# Altium schematic sheet IO.SchDoc
size A4
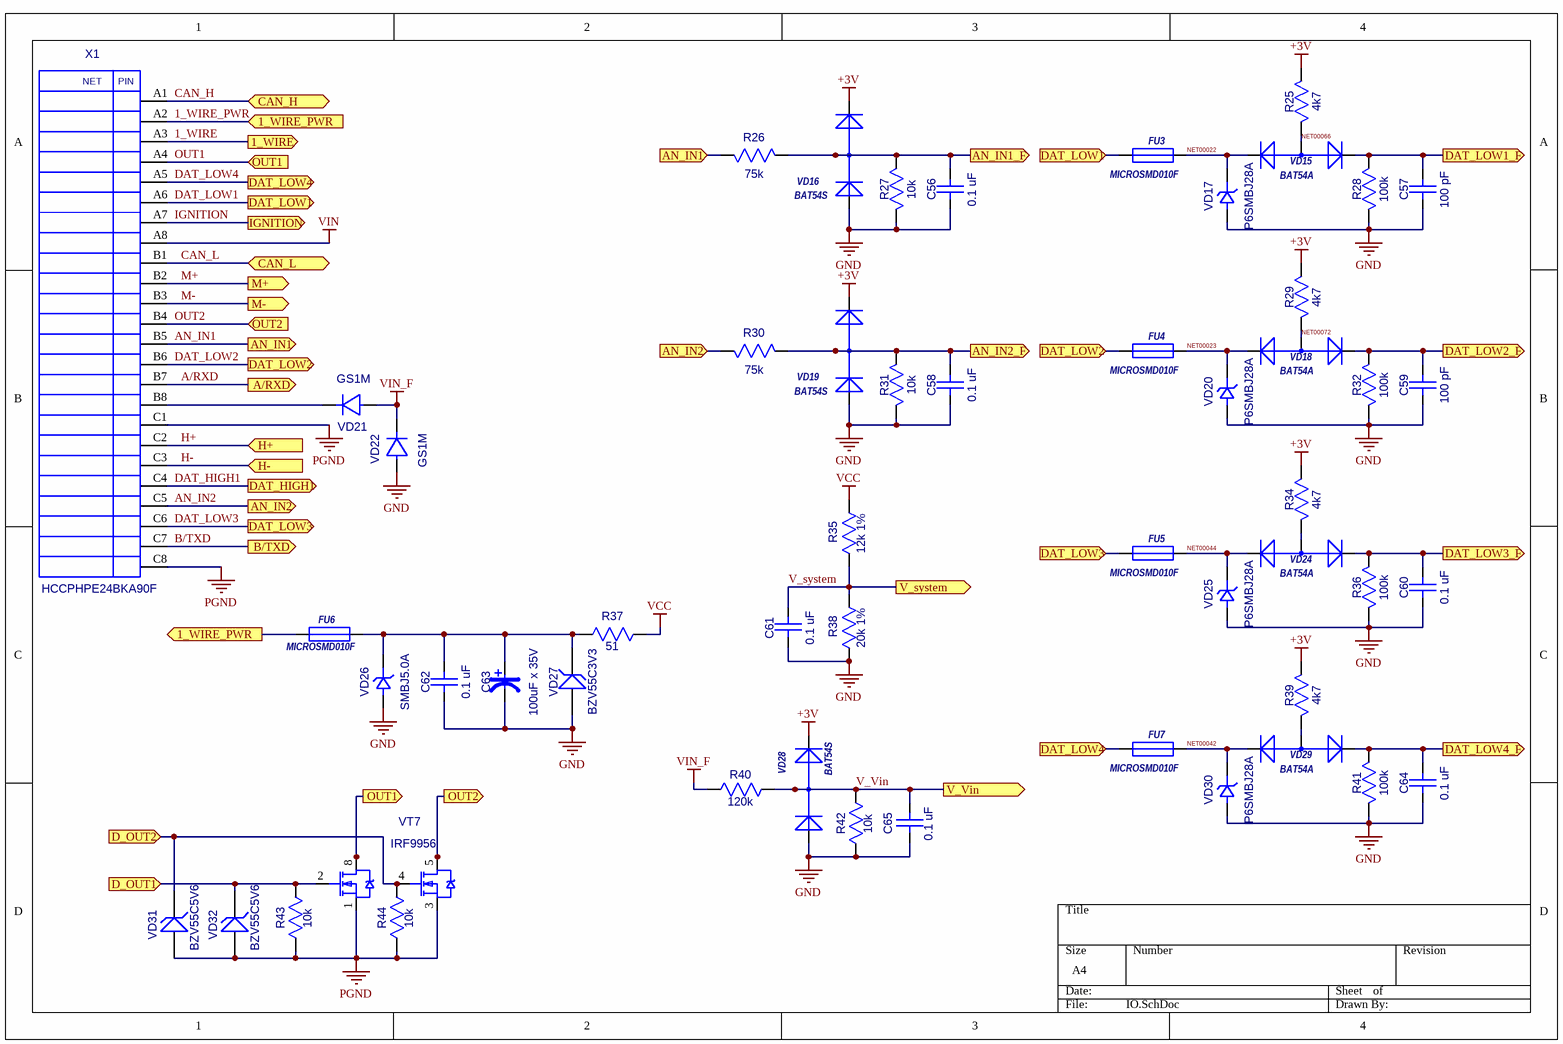
[diagram p0: IO.SchDoc]

## Parts
C56  0.1 uF  [CC0603-3M]
C57  100 pF  [CC0603-3M]
C58  0.1 uF  [CC0603-3M]
C59  100 pF  [CC0603-3M]
C60  0.1 uF  [CC0603-3M]
C61  0.1 uF  [CC0603-3M]
C62  0.1 uF  [CC0603-3M]
C63  100uF x 35V  [CC20X2.54]
C64  0.1 uF  [CC0603-3M]
C65  0.1 uF  [CC0603-3M]
FU3  MICROSMD010F  [RC1210]
FU4  MICROSMD010F  [RC1210]
FU5  MICROSMD010F  [RC1210]
FU6  MICROSMD010F  [RC1210]
FU7  MICROSMD010F  [RC1210]
R25  4k7  [RC0603-3M]
R26  75k  [RC0603-3M]
R27  10k  [RC0603-3M]
R28  100k  [RC0603-3M]
R29  4k7  [RC0603-3M]
R30  75k  [RC0603-3M]
R31  10k  [RC0603-3M]
R32  100k  [RC0603-3M]
R34  4k7  [RC0603-3M]
R35  12k 1%  [RC0603-3M]
R36  100k  [RC0603-3M]
R37  51  [RC1206-2M]
R38  20k 1%  [RC0603-3M]
R39  4k7  [RC0603-3M]
R40  120k  [RC0603-3M]
R41  100k  [RC0603-3M]
R42  10k  [RC0603-3M]
R43  10k  [RC0603-3M]
R44  10k  [RC0603-3M]
VD15  BAT54A  [SOT-23(123)]
VD16  BAT54S  [SOT-23(GSD)]
VD17  P6SMBJ28A  [SMB]
VD18  BAT54A  [SOT-23(123)]
VD19  BAT54S  [SOT-23(GSD)]
VD20  P6SMBJ28A  [SMB]
VD21  GS1M  [SMA]
VD22  GS1M  [SMA]
VD24  BAT54A  [SOT-23(123)]
VD25  P6SMBJ28A  [SMB]
VD26  SMBJ5.0A  [SMB]
VD27  BZV55C3V3  [SOD-80]
VD28  BAT54S  [SOT-23(GSD)]
VD29  BAT54A  [SOT-23(123)]
VD30  P6SMBJ28A  [SMB]
VD31  BZV55C5V6  [SOD-80]
VD32  BZV55C5V6  [SOD-80]
VT7  IRF9956  [SO-8]
X1  HCCPHPE24BKA90F  [HCCPHPE24BKA90F_HCCPHPE24BKA90F(Primary)]

## Ports
1_WIRE (out), 1_WIRE_PWR (in), 1_WIRE_PWR (out), A/RXD, AN_IN1 (in), AN_IN1 (out), AN_IN1_F (out), AN_IN2 (in), AN_IN2 (out), AN_IN2_F (out), B/TXD, CAN_H (bidir), CAN_L (bidir), D_OUT1 (in), D_OUT2 (in), DAT_HIGH1 (out), DAT_LOW1 (in), DAT_LOW1 (out), DAT_LOW1_F (out), DAT_LOW2 (in), DAT_LOW2 (out), DAT_LOW2_F (out), DAT_LOW3 (in), DAT_LOW3 (out), DAT_LOW3_F (out), DAT_LOW4 (in), DAT_LOW4 (out), DAT_LOW4_F (out), H+ (in), H- (in), IGNITION (out), M+ (out), M- (out), OUT1 (in), OUT1 (out), OUT2 (in), OUT2 (out), V_system (out), V_Vin (out)

## Nets
+3V: R25.1(A) R29.1(A) R34.1(A) R39.1(A) VD16.2(K) VD19.2(K) VD28.2(K)
GND: C56.1(A) C57.1(A) C58.1(A) C59.1(A) C60.1(A) C61.2(B) C62.1(A) C63.2(minus) C64.1(A) C65.2(B) R27.2(B) R28.2(B) R31.2(B) R32.2(B) R36.2(B) R38.1(A) R41.2(B) R42.2(B) VD16.1(A) VD17.1(A) VD19.1(A) VD20.1(A) VD22.1(A) VD25.1(A) VD26.1(A) VD27.1(A) VD28.1(A) VD30.1(A)
PGND: R43.2(B) R44.2(B) VD31.1(A) VD32.1(A) VT7.1(S) VT7.3(S) X1.C1 X1.C8
VCC: R35.2(B) R37.2(B)
VIN: X1.A8
VIN_F: R40.2(B) VD21.1(A) VD22.2(K)
1_WIRE: X1.A3 ; port 1_WIRE
1_WIRE_PWR: FU6.2 X1.A2 ; port 1_WIRE_PWR
A/RXD: X1.B7 ; port A/RXD
AN_IN1: R26.2(B) X1.B5 ; port AN_IN1
AN_IN1_F: C56.2(B) R26.1(A) R27.1(A) VD16.3(AK) ; port AN_IN1_F
AN_IN2: R30.2(B) X1.C5 ; port AN_IN2
AN_IN2_F: C58.2(B) R30.1(A) R31.1(A) VD19.3(AK) ; port AN_IN2_F
B/TXD: X1.C7 ; port B/TXD
CAN_H: X1.A1 ; port CAN_H
CAN_L: X1.B1 ; port CAN_L
D_OUT1: R43.1(A) VD32.2 VT7.2(G) ; port D_OUT1
D_OUT2: R44.1(A) VD31.2 VT7.4(G) ; port D_OUT2
DAT_HIGH1: X1.C4 ; port DAT_HIGH1
DAT_LOW1: FU3.2 X1.A6 ; port DAT_LOW1
DAT_LOW1_F: C57.2(B) R28.1(A) VD15.2(K) ; port DAT_LOW1_F
DAT_LOW2: FU4.2 X1.B6 ; port DAT_LOW2
DAT_LOW2_F: C59.2(B) R32.1(A) VD18.2(K) ; port DAT_LOW2_F
DAT_LOW3: FU5.2 X1.C6 ; port DAT_LOW3
DAT_LOW3_F: C60.2(B) R36.1(A) VD24.2(K) ; port DAT_LOW3_F
DAT_LOW4: FU7.2 X1.A5 ; port DAT_LOW4
DAT_LOW4_F: C64.2(B) R41.1(A) VD29.2(K) ; port DAT_LOW4_F
H+: X1.C2 ; port H+
H-: X1.C3 ; port H-
IGNITION: X1.A7 ; port IGNITION
M+: X1.B2 ; port M+
M-: X1.B3 ; port M-
NET00022: FU3.1 VD15.1(K) VD17.2(K)
NET00023: FU4.1 VD18.1(K) VD20.2(K)
NET00042: FU7.1 VD29.1(K) VD30.2(K)
NET00044: FU5.1 VD24.1(K) VD25.2(K)
NET00066: R25.2(B) VD15.3(A)
NET00072: R29.2(B) VD18.3(A)
OUT1: VT7.7(D) VT7.8(D) X1.A4 ; port OUT1
OUT2: VT7.5(D) VT7.6(D) X1.B4 ; port OUT2
V_system: C61.1(A) R35.1(A) R38.2(B) ; port V_system
V_Vin: C65.1(A) R40.1(A) R42.1(A) VD28.3(AK) ; port V_Vin
NetC62_2: C62.2(B) C63.1(plus) FU6.1 R37.1(A) VD26.2(K) VD27.2
NetR34_2: R34.2(B) VD24.3(A)
NetR39_2: R39.2(B) VD29.3(A)
NetVD21_2: VD21.2(K) X1.B8

## Notes on the sheet
- (in symbol HCCPHPE24BKA90F) NET; PIN

## Library data of the parts
C56-C62 C64 C65 = CC0603
  C56 C58 C60-C62 C64 C65: Value: 0.1 uF
  C57 C59: Value: 100 pF
C63 = CAP0.25: Value: 100uF x 35V
FU3-FU7 = MICROSMD: Value: MICROSMD010F
R25-R32 R34-R36 R38-R44 = RC0603
  R25 R29 R34 R39: Value: 4k7
  R26 R30: Value: 75k
  R27 R31 R42-R44: Value: 10k
  R28 R32 R36 R41: Value: 100k
  R35: Value: 12k 1%
  R38: Value: 20k 1%
  R40: Value: 120k
R37 = RC1206: Value: 51
VD15 VD18 VD24 VD29 = BAT54A: ComponentField6: Published 8-Jun-2000, Modified 11-July-2000: SIM Model Added.; Description: 1.0 Ampere General Purpose Rectifier; Value: *
VD16 VD19 = BAT54S: ComponentField6: Published 8-Jun-2000, Modified 11-July-2000: SIM Model Added.; Description: 1.0 Ampere General Purpose Rectifier; Value: *
VD17 VD20 VD25 VD26 VD30 = SMBJ
  VD17 VD20 VD25 VD30: Value: P6SMBJ28A
  VD26: Value: SMBJ5.0A
VD21 VD22 = GS1M: Value: {Value}
VD27 = BZV55C12: OriginalName: BZX84C10LT1; Description: Zener Voltage Regulator Diode; ComponentField6: Pin 2 is not connected and not drawn.; ComponentField7: Published 29-Sep-2000; Value: BZV55C3V3
VD28 = BAT54S: 1.0 Ampere General Purpose Rectifier; ComponentField6: Published 8-Jun-2000, Modified 11-July-2000: SIM Model Added.; Value: *
VD31 VD32 = BZV55C3V0: OriginalName: BZX84C10LT1; Description: Zener Voltage Regulator Diode; ComponentField6: Pin 2 is not connected and not drawn.; ComponentField7: Published 29-Sep-2000; Value: BZV55C5V6
VT7 = IRF9956: OriginalName: IRLML2402; Description: HEXFET Power MOSFET; ComponentField7: Published 8-Jun-2000
X1 = HCCPHPE24BKA90F: Value: *